# Altium schematic sheet Sheet3.SchDoc
size A4
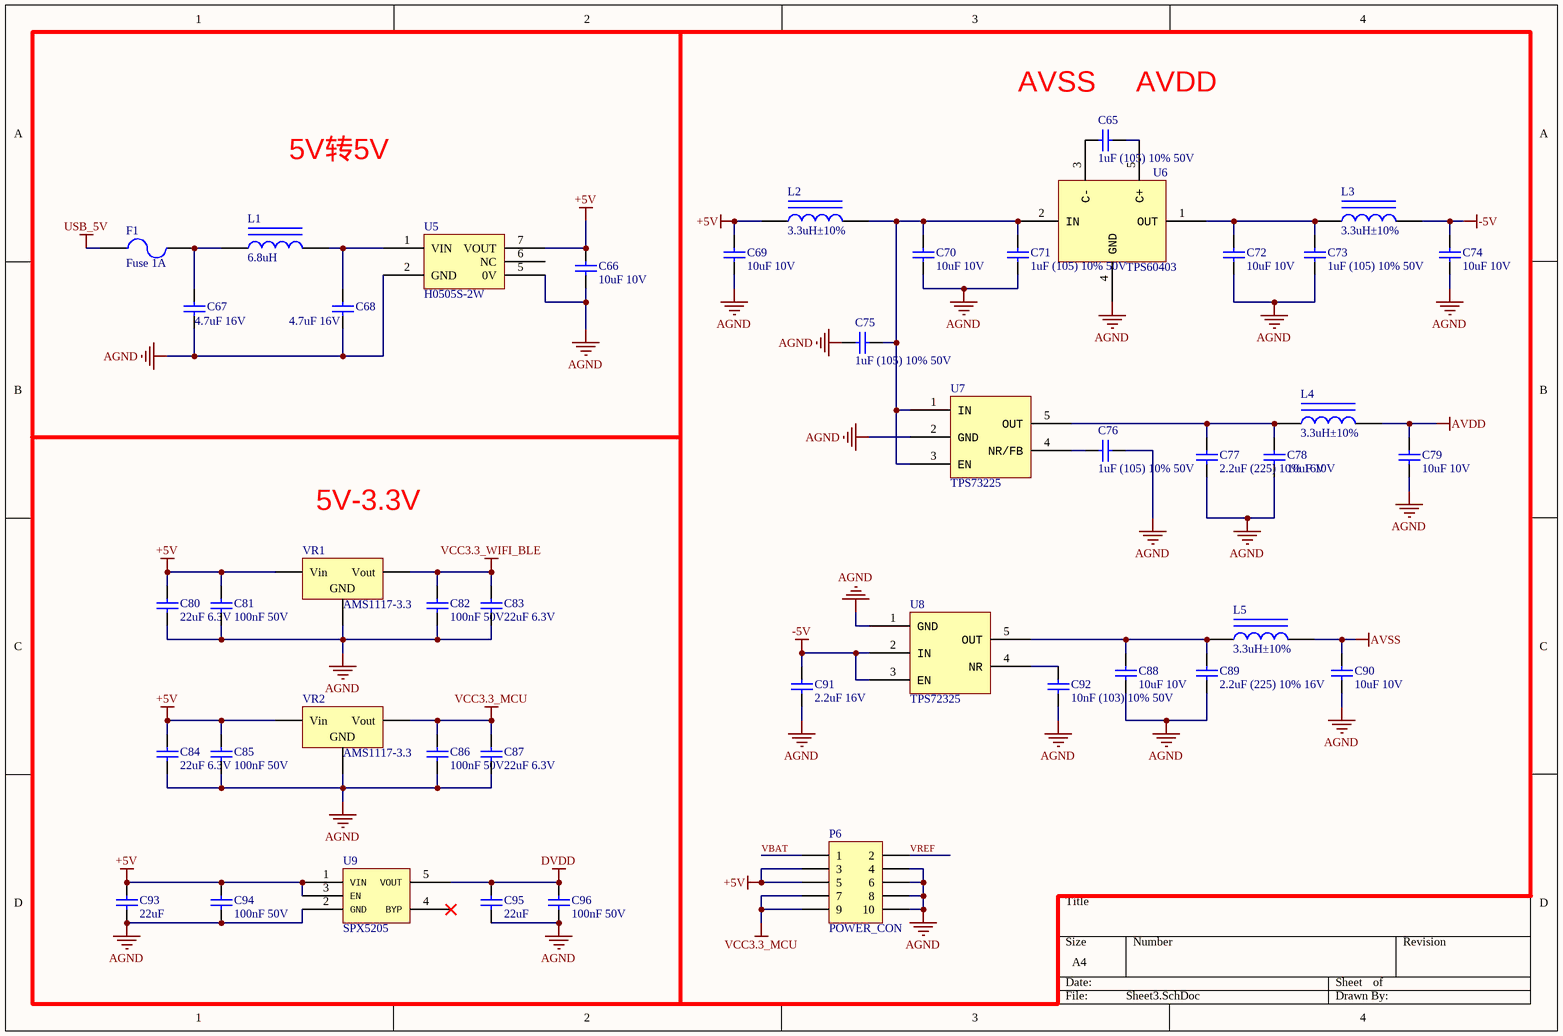
[diagram p0: Sheet3.SchDoc]

## Parts
C65  1uF (105) 10% 50V  [0603_C]
C66  10uF 10V  [0603_C]
C67  4.7uF 16V  [0603_C]
C68  4.7uF 16V  [0603_C]
C69  10uF 10V  [0603_C]
C70  10uF 10V  [0603_C]
C71  1uF (105) 10% 50V  [0603_C]
C72  10uF 10V  [0603_C]
C73  1uF (105) 10% 50V  [0603_C]
C74  10uF 10V  [0603_C]
C75  1uF (105) 10% 50V  [0603_C]
C76  1uF (105) 10% 50V  [0603_C]
C77  2.2uF (225) 10% 16V  [0603_C]
C78  10uF 10V  [0603_C]
C79  10uF 10V  [0603_C]
C80  22uF 6.3V  [0603_C]
C81  100nF 50V  [0603_C]
C82  100nF 50V  [0603_C]
C83  22uF 6.3V  [0603_C]
C84  22uF 6.3V  [0603_C]
C85  100nF 50V  [0603_C]
C86  100nF 50V  [0603_C]
C87  22uF 6.3V  [0603_C]
C88  10uF 10V  [0603_C]
C89  2.2uF (225) 10% 16V  [0603_C]
C90  10uF 10V  [0603_C]
C91  2.2uF 16V  [0603_C]
C92  10nF (103) 10% 50V  [0603_C]
C93  22uF  [0603_C]
C94  100nF 50V  [0603_C]
C95  22uF  [0603_C]
C96  100nF 50V  [0603_C]
F1  Fuse 1A  [0805_R]
L1  6.8uH  [0603_L]
L2  3.3uH±10%  [0805_L]
L3  3.3uH±10%  [0805_L]
L4  3.3uH±10%  [0805_L]
L5  3.3uH±10%  [0805_L]
P6  POWER_CON  [HDR2X5]
U5  H0505S-2W  [H0505S]
U6  TPS60403  [SOT-23-5]
U7  TPS73225  [SOT-23-5]
U8  TPS72325  [SOT-23-5]
U9  SPX5205  [SOT-23-5]
VR1  AMS1117-3.3  [SOT-223]
VR2  AMS1117-3.3  [SOT-223]

## Nets
+5V: C66.2 C69.2 C80.2 C81.2 C84.2 C85.2 C93.2 C94.2 L2.1 P6.3 P6.5 U5.7(VOUT) U9.1(VIN) U9.3(EN) VR1.3(Vin) VR2.3(Vin)
-5V: C74.2 C91.2 L3.2 U8.2(IN) U8.3(EN)
AGND: C66.1 C67.1 C68.1 C69.1 C70.1 C71.1 C72.1 C73.1 C74.1 C75.2 C76.1 C77.1 C78.1 C79.1 C80.1 C81.1 C82.1 C83.1 C84.1 C85.1 C86.1 C87.1 C88.1 C89.1 C90.1 C91.1 C92.1 C93.1 C94.1 C95.1 C96.1 P6.4 P6.6 P6.8 P6.10 U5.2(GND) U5.5(0V) U6.4(GND) U7.2(GND) U8.1(GND) U9.2(GND) VR1.1(GND) VR2.1(GND)
AVDD: C79.2 L4.2
AVSS: C90.2 L5.2
DVDD: C95.2 C96.2 U9.5(VOUT)
USB_5V: F1.1
VCC3.3_MCU: C86.2 C87.2 P6.7 P6.9 VR2.2(Vout)
VCC3.3_WIFI_BLE: C82.2 C83.2 VR1.2(Vout)
VBAT: P6.1
VREF: P6.2
NetC65_1: C65.1 U6.5(C+)
NetC65_2: C65.2 U6.3(C-)
NetC67_2: C67.2 F1.2 L1.1
NetC68_2: C68.2 L1.2 U5.1(VIN)
NetC70_2: C70.2 C71.2 C75.1 L2.2 U6.2(IN) U7.1(IN) U7.3(EN)
NetC72_2: C72.2 C73.2 L3.1 U6.1(OUT)
NetC76_2: C76.2 U7.4(NR/FB)
NetC77_2: C77.2 C78.2 L4.1 U7.5(OUT)
NetC88_2: C88.2 C89.2 L5.1 U8.5(OUT)
NetC92_2: C92.2 U8.4(NR)

Not connected (* = marked no-connect by the designer): U5 6(NC); U9 4(BYP)*

## Notes on the sheet
- (near C65) AVSS     AVDD
- 5V转5V
- 5V-3.3V

## Library data of the parts
C65 C71 C73 C75 C76 = 0603 1uF (105) 10% 50V: 贴片电容; ComponentLink1Description: 供应商链接; ComponentLink1URL: http://www.szlcsc.com/product/details_16531.html; Package: 0603; Supplier: LC; SuppliersPartNumber: C15849
C66 C69 C70 C72 C74 C78 C79 C88 C90 = 0603 10uF (106) 10% 10V: 贴片电容; ComponentLink1Description: 供应商链接; ComponentLink1URL: http://www.szlcsc.com/product/details_20411.html; Package: 0603; Supplier: LC; SuppliersPartNumber: C19702
C67 C68 = 0603 4.7uF (475) 10% 16V: 贴片电容; ComponentLink1Description: 供应商链接; ComponentLink1URL: http://www.szlcsc.com/product/details_20375.html; Package: 0603; Supplier: LC; SuppliersPartNumber: C19666
C77 C89 C91 = 0603 2.2uF (225) 10% 16V: 贴片电容; ComponentLink1Description: 供应商链接; ComponentLink1URL: http://www.szlcsc.com/product/details_24366.html; Package: 0603; Supplier: LC; SuppliersPartNumber: C23630
C80 C83 C84 C87 C93 C95 = 0603 22uF (226) 20% 6.3V: 贴片电容; ComponentLink1Description: 供应商链接; ComponentLink1URL: http://www.szlcsc.com/product/details_60514.html; Package: 0603; Supplier: LC; SuppliersPartNumber: C59461
C81 C82 C85 C86 C94 C96 = 0603 100nF (104) 10% 50V: 贴片电容; ComponentLink1Description: 供应商链接; ComponentLink1URL: http://www.szlcsc.com/product/details_15331.html; Package: 0603; Supplier: LC; SuppliersPartNumber: C14663
C92 = 0603 10nF (103) 10% 50V: 贴片电容; ComponentLink1Description: 供应商链接; ComponentLink1URL: http://www.szlcsc.com/product/details_58143.html; Package: 0603; Supplier: LC; SuppliersPartNumber: C57112
F1 = Fuse 2: Fuse; Published: 8-Jun-2000; LatestRevisionDate: 17-Jul-2002; LatestRevisionNote: Re-released for DXP Platform.; PackageReference: PIN-W2/E2.8; Publisher: Altium Limited; PackageDescription: Thru-Hole; 2 Leads
L1 = 0603 4.7uH 10%: 贴片电感; ComponentLink1Description: 供应商链接; ComponentLink1URL: http://www.szlcsc.com/product/details_1386.html; Package: 0603; Supplier: LC; SuppliersPartNumber: C1034
L2-L5 = 0805 3.3uH10%: 贴片电感; ComponentLink1Description: 供应商链接; ComponentLink1URL: http://www.szlcsc.com/product/details_52738.html; Package: 0805; Supplier: LC; SuppliersPartNumber: C51725
P6 = Header 5X2: Header, 5-Pin, Dual row; LatestRevisionDate: 17-Jul-2002; LatestRevisionNote: Re-released for DXP Platform.; Publisher: Altium Limited
VR1 VR2 = SOT-223 AMS1117-3.3: 低压差线性稳压(LDO); ComponentLink1Description: 供应商链接; ComponentLink1URL: http://www.szlcsc.com/product/details_6652.html; Package: SOT-223; Supplier: LC; SuppliersPartNumber: C6186